# EAGLE design simple (EAGLE 7.6.0)
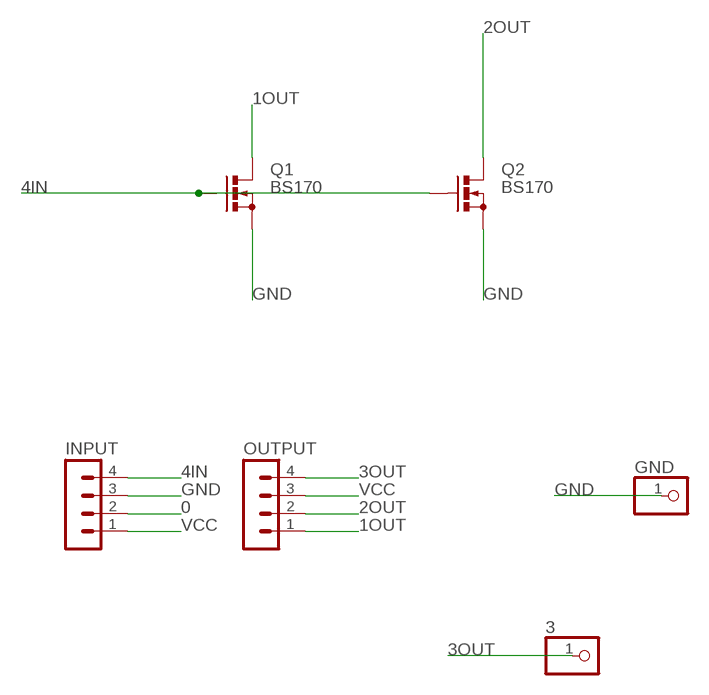
[diagram p0: schematic, sheet 1]

## Parts
3  PINHD-1X1CB  [1X01-CLEANBIG]
GND  PINHD-1X1CB  [1X01-CLEANBIG]
INPUT  MA04-1  [MA04-1]
OUTPUT  MA04-1  [MA04-1]
Q1  BS170  [SOT54E]
Q2  BS170  [SOT54E]

## Nets
0: INPUT.2
1OUT: OUTPUT.1 Q1.D
2OUT: OUTPUT.2 Q2.D
3OUT: 3.1 OUTPUT.4
4IN: INPUT.4 Q1.G Q2.G
GND: GND.1 INPUT.3 Q1.S Q2.S
VCC: INPUT.1 OUTPUT.3

## Library data of the parts
3 GND = adafruit:PINHD-1X1: Pin header 1x1 for 0.1" spacing With round pins
INPUT OUTPUT = con-lstb:MA04-1: PIN HEADER; OC_FARNELL: unknown; OC_NEWARK: unknown
Q1 Q2 = transistor-small-signal:BS170: N-CHANNEL MOS FET

## Board
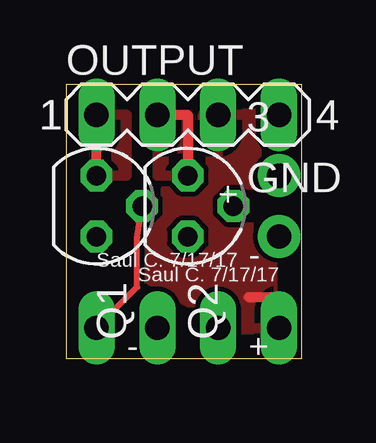
[diagram p1: board, top side]
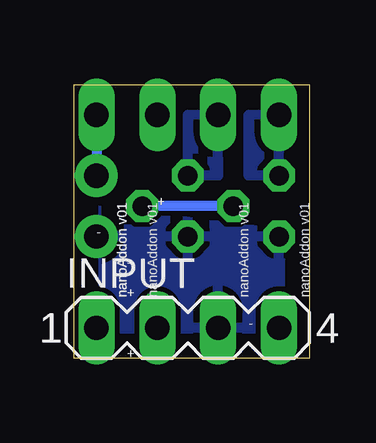
[diagram p2: board, bottom side, seen from below]

Size 9.83 x 11.42 mm. Coordinates in mm from the lower left corner, seen from the top.
Outline: 0,0 9.83,0 9.83,11.42 0,11.42 0,0
Copper layers (1*16): Top 0.035mm / dielectric 1.5mm / Bottom 0.035mm
Design rules "default": minimum track width 10mil, minimum drill 24mil, track to track 8mil, track to pad 8mil, pad to pad 8mil, via to via 8mil, smd to smd 8mil, copper to edge 40mil, drill to drill 8mil, minimum pad ring 10mil, minimum via ring 8mil, stop-mask expansion 4mil, vias tented up to drill 0mil, thermal gap 10mil

### Footprints (pad centres in the part's own frame; a part is rotated, then mirrored left to right if it is on the bottom)
1X01-CLEANBIG = drill 1.016 pad 1.778: 1 0,0
MA04-1 = drill 1.016 long: 1 -3.81,0; 2 -1.27,0; 3 1.27,0; 4 3.81,0
SOT54E = drill 0.813 octagon: D -1.27,0; G 0,1.905; S 1.27,0

### Placement (x,y rotation side)
3  8.89,7.62 0 top
GND  8.89,5.08 0 top
INPUT  5.08,1.27 0 bottom
OUTPUT  5.08,10.16 0 top
Q1  1.27,6.35 270 top
Q2  5.08,6.35 270 top

### Tracks (layer width: path | path; a pad name or v marks a point on that pad's centre or on a via)
1OUT
  Top 0.406: Q1.D OUTPUT.1
  pour Bottom: 0,10.16 0,7.62 2.54,7.62 2.54,10.16
  pour Top: 1.27,10.16 1.27,7.62 2.54,7.62 2.54,10.16
2OUT
  Top 0.406: OUTPUT.2 5.08,10.16 Q2.D
  pour Bottom: 3.81,10.16 3.81,7.62 5.08,7.62 5.08,10.16
  pour Top: 3.81,10.16 3.81,7.62 5.08,7.62 5.08,10.16
3OUT
  Bottom 0.406: OUTPUT.4 3.1
4IN
  Top 0.254: INPUT.4 2.97,2.97 2.97,5.03 Q1.G
  Bottom 0.406: Q1.G Q2.G
GND
  pour Bottom: 0,5.08 0,0 10.16,0 10.16,6.35
VCC
  Top 0.406: INPUT.1 8.89,2.54 7.62,2.54 | OUTPUT.3 6.35,8.89
  pour Top: 6.35,11.43 2.54,3.81 11.43,-1.27 11.43,11.43
  pour Top: 7.62,0 7.62,2.54 8.89,2.54 8.89,0

### Text on the board
tPlace: + | Saul C. 7/17/17 | - | Saul C. 7/17/17 | - | +
bPlace: + | - | - | nanoAddon v01 | nanoAddon v01 | nanoAddon v01 | + | nanoAddon v01 | nanoAddon v01 | - | +